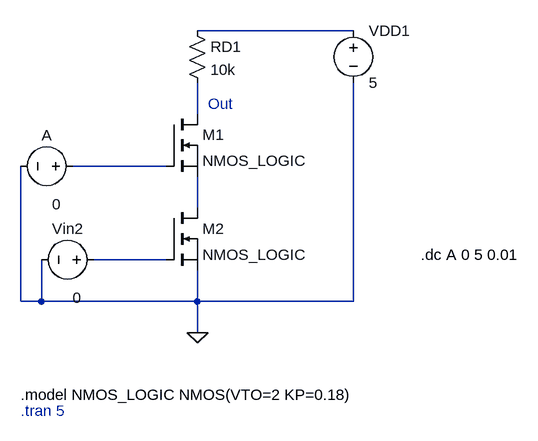
[diagram p0: schematic NMOS_NAND.asc]
NMOS_NAND.asc, the LTspice schematic file:
Version 4.1
SHEET 1 880 680
WIRE 448 -80 208 -80
WIRE 208 48 208 0
WIRE 160 128 16 128
WIRE 208 192 208 144
WIRE 160 272 48 272
WIRE -64 336 -64 128
WIRE -32 336 -32 272
WIRE -32 336 -64 336
WIRE 208 336 208 288
WIRE 208 336 -32 336
WIRE 448 336 448 0
WIRE 448 336 208 336
WIRE 208 384 208 336
FLAG 208 384 0
SYMBOL nmos 160 48 R0
SYMATTR InstName M1
SYMATTR Value NMOS_LOGIC
SYMBOL res 192 -96 R0
SYMATTR InstName RD1
SYMATTR Value 10k
SYMBOL voltage 448 -96 R0
WINDOW 123 0 0 Left 0
WINDOW 39 0 0 Left 0
SYMATTR InstName VDD1
SYMATTR Value 5
SYMBOL voltage 32 128 R90
WINDOW 0 -32 56 VBottom 2
WINDOW 3 43 41 VTop 2
WINDOW 123 0 0 Left 0
WINDOW 39 0 0 Left 0
SYMATTR InstName A
SYMATTR Value 0
SYMBOL nmos 160 192 R0
SYMATTR InstName M2
SYMATTR Value NMOS_LOGIC
SYMBOL voltage 64 272 R90
WINDOW 0 -32 56 VBottom 2
WINDOW 3 43 41 VTop 2
WINDOW 123 0 0 Left 0
WINDOW 39 0 0 Left 0
SYMATTR InstName Vin2
SYMATTR Value 0
TEXT -64 480 Left 2 !.model NMOS_LOGIC NMOS(VTO=2 KP=0.18)
TEXT 224 32 Left 2 ;Out
TEXT -64 504 Left 2 ;.tran 5
TEXT 552 264 Left 2 !.dc A 0 5 0.01

The netlist it stands for:
* NMOS_NAND.asc
M1 N002 N003 N004 N004 NMOS_LOGIC
RD1 N001 N002 10k
VDD1 N001 0 5
V§A N003 0 0
M2 N004 N005 0 0 NMOS_LOGIC
Vin2 N005 0 0
.model NMOS NMOS
.model PMOS PMOS
.lib standard.mos
.model NMOS_LOGIC NMOS(VTO=2 KP=0.18)
* Out
* .tran 5
.dc A 0 5 0.01
.backanno
.end